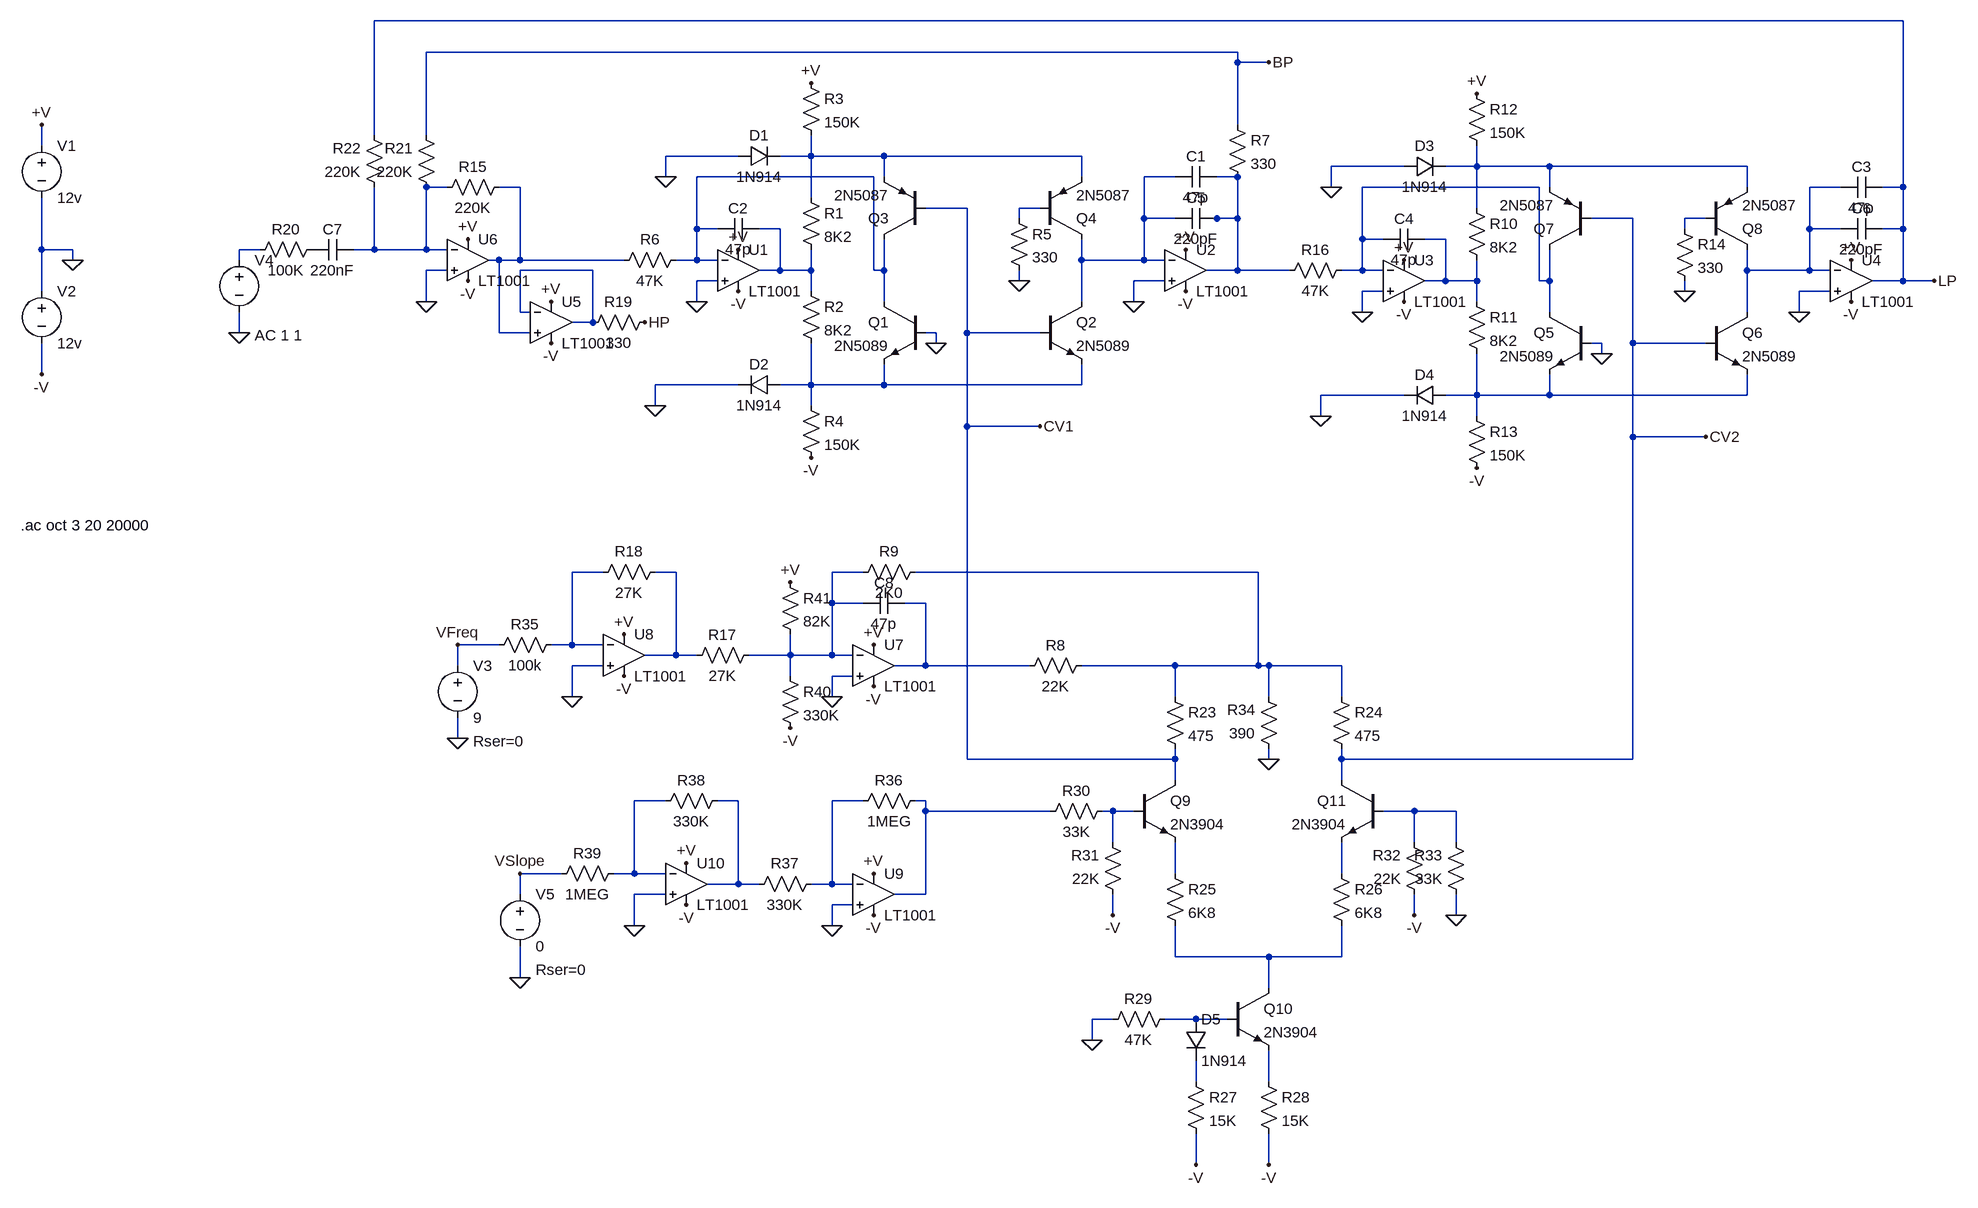
[diagram p0: schematic Serge%20VCFS.asc]
Serge%20VCFS.asc, the LTspice schematic file:
Version 4
SHEET 1 2620 1656
WIRE 2496 -176 144 -176
WIRE 1472 -128 224 -128
WIRE 1472 -112 1472 -128
WIRE 1520 -112 1472 -112
WIRE 1472 -16 1472 -112
WIRE 144 0 144 -176
WIRE 224 0 224 -128
WIRE -368 16 -368 -16
WIRE 704 32 592 32
WIRE 816 32 816 0
WIRE 816 32 768 32
WIRE 928 32 816 32
WIRE 1232 32 928 32
WIRE 1728 48 1616 48
WIRE 1840 48 1840 16
WIRE 1840 48 1792 48
WIRE 1952 48 1840 48
WIRE 2256 48 1952 48
WIRE 592 64 592 32
WIRE 912 64 640 64
WIRE 928 64 928 32
WIRE 1232 64 1232 32
WIRE 1376 64 1328 64
WIRE 1472 64 1440 64
WIRE 256 80 224 80
WIRE 368 80 336 80
WIRE 1616 80 1616 48
WIRE 1936 80 1664 80
WIRE 1952 80 1952 48
WIRE 2256 80 2256 48
WIRE 2400 80 2352 80
WIRE 2496 80 2496 -176
WIRE 2496 80 2464 80
WIRE 816 96 816 32
WIRE 1056 112 992 112
WIRE 1168 112 1136 112
WIRE 1840 112 1840 48
WIRE 1136 128 1136 112
WIRE 1328 128 1328 64
WIRE 1376 128 1328 128
WIRE 1440 128 1424 128
WIRE 1472 128 1472 64
WIRE 1472 128 1440 128
WIRE 2080 128 2016 128
WIRE 2192 128 2160 128
WIRE 640 144 640 64
WIRE 672 144 640 144
WIRE 768 144 736 144
WIRE 2160 144 2160 128
WIRE 2352 144 2352 80
WIRE 2400 144 2352 144
WIRE 2496 144 2496 80
WIRE 2496 144 2464 144
WIRE 1664 160 1664 80
WIRE 1696 160 1664 160
WIRE 1792 160 1760 160
WIRE -368 176 -368 96
WIRE -320 176 -368 176
WIRE -32 176 -64 176
WIRE 144 176 144 80
WIRE 144 176 112 176
WIRE 224 176 224 80
WIRE 224 176 144 176
WIRE 256 176 224 176
WIRE -320 192 -320 176
WIRE -64 192 -64 176
WIRE 336 192 320 192
WIRE 368 192 368 80
WIRE 368 192 336 192
WIRE 528 192 368 192
WIRE 640 192 640 144
WIRE 640 192 608 192
WIRE 672 192 640 192
WIRE 1232 192 1232 160
WIRE 1328 192 1328 128
WIRE 1328 192 1232 192
WIRE 1360 192 1328 192
WIRE 256 208 224 208
WIRE 480 208 368 208
WIRE 768 208 768 144
WIRE 768 208 736 208
WIRE 816 208 816 176
WIRE 816 208 768 208
WIRE 912 208 912 64
WIRE 928 208 928 160
WIRE 928 208 912 208
WIRE 1472 208 1472 128
WIRE 1472 208 1424 208
WIRE 1552 208 1472 208
WIRE 1664 208 1664 160
WIRE 1664 208 1632 208
WIRE 1696 208 1664 208
WIRE 2256 208 2256 176
WIRE 2352 208 2352 144
WIRE 2352 208 2256 208
WIRE 2384 208 2352 208
WIRE 672 224 640 224
WIRE 1136 224 1136 208
WIRE 1360 224 1312 224
WIRE 1792 224 1792 160
WIRE 1792 224 1760 224
WIRE 1840 224 1840 192
WIRE 1840 224 1792 224
WIRE 1936 224 1936 80
WIRE 1952 224 1952 176
WIRE 1952 224 1936 224
WIRE 2496 224 2496 144
WIRE 2496 224 2448 224
WIRE 2544 224 2496 224
WIRE -368 240 -368 176
WIRE 816 240 816 208
WIRE 1696 240 1664 240
WIRE 2160 240 2160 224
WIRE 2384 240 2336 240
WIRE 224 256 224 208
WIRE 640 256 640 224
WIRE 928 256 928 208
WIRE 1232 256 1232 192
WIRE 1312 256 1312 224
WIRE 1840 256 1840 224
WIRE 368 272 368 208
WIRE 384 272 368 272
WIRE 1664 272 1664 240
WIRE 1952 272 1952 224
WIRE 2256 272 2256 208
WIRE 2336 272 2336 240
WIRE 480 288 480 208
WIRE 480 288 448 288
WIRE -64 304 -64 272
WIRE 336 304 336 192
WIRE 384 304 336 304
WIRE 1008 304 992 304
WIRE 1056 304 1056 112
WIRE 1168 304 1056 304
WIRE 1008 320 1008 304
WIRE 2032 320 2016 320
WIRE 2080 320 2080 128
WIRE 2192 320 2080 320
WIRE 2032 336 2032 320
WIRE -368 368 -368 320
WIRE 704 384 576 384
WIRE 816 384 816 320
WIRE 816 384 768 384
WIRE 928 384 928 352
WIRE 928 384 816 384
WIRE 1232 384 1232 352
WIRE 1232 384 928 384
WIRE 1728 400 1600 400
WIRE 1840 400 1840 336
WIRE 1840 400 1792 400
WIRE 1952 400 1952 368
WIRE 1952 400 1840 400
WIRE 2256 400 2256 368
WIRE 2256 400 1952 400
WIRE 576 416 576 384
WIRE 816 416 816 384
WIRE 1600 432 1600 400
WIRE 1840 432 1840 400
WIRE 1056 448 1056 304
WIRE 1168 448 1056 448
WIRE 2080 464 2080 320
WIRE 2192 464 2080 464
WIRE 496 672 448 672
WIRE 608 672 576 672
WIRE 896 672 848 672
WIRE 1504 672 976 672
WIRE 848 720 848 672
WIRE 896 720 848 720
WIRE 992 720 960 720
WIRE 336 784 272 784
WIRE 448 784 448 672
WIRE 448 784 416 784
WIRE 496 784 448 784
WIRE 608 800 608 672
WIRE 608 800 560 800
WIRE 640 800 608 800
WIRE 784 800 784 768
WIRE 784 800 720 800
WIRE 848 800 848 720
WIRE 848 800 784 800
WIRE 880 800 848 800
WIRE 272 816 272 784
WIRE 496 816 448 816
WIRE 992 816 992 720
WIRE 992 816 944 816
WIRE 1152 816 992 816
WIRE 1376 816 1232 816
WIRE 1504 816 1504 672
WIRE 1504 816 1376 816
WIRE 1520 816 1504 816
WIRE 1632 816 1520 816
WIRE 784 832 784 800
WIRE 880 832 848 832
WIRE 448 864 448 816
WIRE 848 864 848 832
WIRE 1376 864 1376 816
WIRE 1520 864 1520 816
WIRE 1632 864 1632 816
WIRE 272 928 272 896
WIRE 1056 960 1056 448
WIRE 1376 960 1376 944
WIRE 1376 960 1056 960
WIRE 1520 960 1520 944
WIRE 1632 960 1632 944
WIRE 2080 960 2080 464
WIRE 2080 960 1632 960
WIRE 1376 992 1376 960
WIRE 1632 992 1632 960
WIRE 592 1024 544 1024
WIRE 704 1024 672 1024
WIRE 896 1024 848 1024
WIRE 992 1024 976 1024
WIRE 992 1040 992 1024
WIRE 1184 1040 992 1040
WIRE 1280 1040 1264 1040
WIRE 1312 1040 1280 1040
WIRE 1744 1040 1696 1040
WIRE 1808 1040 1744 1040
WIRE 1280 1088 1280 1040
WIRE 1744 1088 1744 1040
WIRE 1808 1088 1808 1040
WIRE 432 1136 368 1136
WIRE 544 1136 544 1024
WIRE 544 1136 512 1136
WIRE 592 1136 544 1136
WIRE 1376 1136 1376 1088
WIRE 1632 1136 1632 1088
WIRE 704 1152 704 1024
WIRE 704 1152 656 1152
WIRE 736 1152 704 1152
WIRE 848 1152 848 1024
WIRE 848 1152 816 1152
WIRE 880 1152 848 1152
WIRE 368 1168 368 1136
WIRE 592 1168 544 1168
WIRE 992 1168 992 1040
WIRE 992 1168 944 1168
WIRE 880 1184 848 1184
WIRE 1280 1200 1280 1168
WIRE 1744 1200 1744 1168
WIRE 1808 1200 1808 1168
WIRE 544 1216 544 1168
WIRE 848 1216 848 1184
WIRE 1376 1264 1376 1216
WIRE 1520 1264 1376 1264
WIRE 1632 1264 1632 1216
WIRE 1632 1264 1520 1264
WIRE 368 1296 368 1248
WIRE 1520 1312 1520 1264
WIRE 1280 1360 1248 1360
WIRE 1408 1360 1360 1360
WIRE 1456 1360 1408 1360
WIRE 1248 1392 1248 1360
WIRE 1408 1456 1408 1424
WIRE 1520 1456 1520 1408
WIRE 1408 1584 1408 1536
WIRE 1520 1584 1520 1536
FLAG 640 256 0
FLAG 1008 320 0
FLAG 1312 256 0
FLAG 1136 224 0
FLAG 1168 448 CV1
FLAG -368 -16 +V
FLAG 704 176 +V
FLAG 1392 176 +V
FLAG 816 -80 +V
FLAG -368 368 -V
FLAG 704 240 -V
FLAG 816 496 -V
FLAG 1392 240 -V
FLAG -320 192 0
FLAG -64 304 0
FLAG 592 64 0
FLAG 576 416 0
FLAG 1664 272 0
FLAG 2032 336 0
FLAG 2336 272 0
FLAG 2160 240 0
FLAG 2192 464 CV2
FLAG 1728 192 +V
FLAG 2416 192 +V
FLAG 1840 -64 +V
FLAG 1728 256 -V
FLAG 1840 512 -V
FLAG 2416 256 -V
FLAG 1616 80 0
FLAG 1600 432 0
FLAG 416 256 +V
FLAG 288 160 +V
FLAG 416 320 -V
FLAG 288 224 -V
FLAG 224 256 0
FLAG 1520 -112 BP
FLAG 2544 224 LP
FLAG 560 288 HP
FLAG 1520 960 0
FLAG 1808 1200 0
FLAG 1248 1392 0
FLAG 1744 1200 -V
FLAG 1280 1200 -V
FLAG 1408 1584 -V
FLAG 1520 1584 -V
FLAG 848 864 0
FLAG 448 864 0
FLAG 272 928 0
FLAG 272 784 VFreq
FLAG 848 1216 0
FLAG 544 1216 0
FLAG 368 1296 0
FLAG 528 768 +V
FLAG 912 784 +V
FLAG 912 1136 +V
FLAG 624 1120 +V
FLAG 528 832 -V
FLAG 912 848 -V
FLAG 912 1200 -V
FLAG 624 1184 -V
FLAG 368 1136 VSlope
FLAG 784 912 -V
FLAG 784 688 +V
SYMBOL Opamps\\LT1001 704 144 R0
SYMATTR InstName U1
SYMBOL Opamps\\LT1001 1392 144 R0
SYMATTR InstName U2
SYMBOL npn 992 256 M0
SYMATTR InstName Q1
SYMATTR Value 2N5089
SYMBOL npn 1168 256 R0
SYMATTR InstName Q2
SYMATTR Value 2N5089
SYMBOL res 800 80 R0
SYMATTR InstName R1
SYMATTR Value 8K2
SYMBOL res 800 224 R0
SYMATTR InstName R2
SYMATTR Value 8K2
SYMBOL res 800 -96 R0
SYMATTR InstName R3
SYMATTR Value 150K
SYMBOL res 800 400 R0
SYMATTR InstName R4
SYMATTR Value 150K
SYMBOL pnp 992 160 R180
SYMATTR InstName Q3
SYMATTR Value 2N5087
SYMBOL pnp 1168 160 M180
SYMATTR InstName Q4
SYMATTR Value 2N5087
SYMBOL res 1120 112 R0
SYMATTR InstName R5
SYMATTR Value 330
SYMBOL cap 1440 48 R90
WINDOW 0 0 32 VBottom 0
WINDOW 3 32 32 VTop 0
SYMATTR InstName C1
SYMATTR Value 47p
SYMBOL cap 736 128 R90
WINDOW 0 0 32 VBottom 0
WINDOW 3 32 32 VTop 0
SYMATTR InstName C2
SYMATTR Value 47p
SYMBOL voltage -368 0 R0
WINDOW 123 0 0 Left 0
WINDOW 39 0 0 Left 0
SYMATTR InstName V1
SYMATTR Value 12v
SYMBOL voltage -368 224 R0
WINDOW 123 0 0 Left 0
WINDOW 39 0 0 Left 0
SYMATTR InstName V2
SYMATTR Value 12v
SYMBOL voltage -64 176 R0
WINDOW 123 24 132 Left 0
WINDOW 39 0 0 Left 0
SYMATTR Value2 AC 1 1
SYMATTR InstName V4
SYMATTR Value ""
SYMBOL diode 704 48 R270
WINDOW 0 32 32 VTop 0
WINDOW 3 0 32 VBottom 0
SYMATTR InstName D1
SYMATTR Value 1N914
SYMBOL diode 768 368 R90
WINDOW 0 0 32 VBottom 0
WINDOW 3 32 32 VTop 0
SYMATTR InstName D2
SYMATTR Value 1N914
SYMBOL Opamps\\LT1001 1728 160 R0
SYMATTR InstName U3
SYMBOL Opamps\\LT1001 2416 160 R0
SYMATTR InstName U4
SYMBOL npn 2016 272 M0
SYMATTR InstName Q5
SYMATTR Value 2N5089
SYMBOL npn 2192 272 R0
SYMATTR InstName Q6
SYMATTR Value 2N5089
SYMBOL res 1824 96 R0
SYMATTR InstName R10
SYMATTR Value 8K2
SYMBOL res 1824 240 R0
SYMATTR InstName R11
SYMATTR Value 8K2
SYMBOL res 1824 -80 R0
SYMATTR InstName R12
SYMATTR Value 150K
SYMBOL res 1824 416 R0
SYMATTR InstName R13
SYMATTR Value 150K
SYMBOL pnp 2016 176 R180
SYMATTR InstName Q7
SYMATTR Value 2N5087
SYMBOL pnp 2192 176 M180
SYMATTR InstName Q8
SYMATTR Value 2N5087
SYMBOL res 2144 128 R0
SYMATTR InstName R14
SYMATTR Value 330
SYMBOL cap 2464 64 R90
WINDOW 0 0 32 VBottom 0
WINDOW 3 32 32 VTop 0
SYMATTR InstName C3
SYMATTR Value 47p
SYMBOL cap 1760 144 R90
WINDOW 0 0 32 VBottom 0
WINDOW 3 32 32 VTop 0
SYMATTR InstName C4
SYMATTR Value 47p
SYMBOL res 1648 192 R90
WINDOW 0 0 56 VBottom 0
WINDOW 3 32 56 VTop 0
SYMATTR InstName R16
SYMATTR Value 47K
SYMBOL diode 1728 64 R270
WINDOW 0 32 32 VTop 0
WINDOW 3 0 32 VBottom 0
SYMATTR InstName D3
SYMATTR Value 1N914
SYMBOL diode 1792 384 R90
WINDOW 0 0 32 VBottom 0
WINDOW 3 32 32 VTop 0
SYMATTR InstName D4
SYMATTR Value 1N914
SYMBOL cap 1440 112 R90
WINDOW 0 0 32 VBottom 0
WINDOW 3 32 32 VTop 0
SYMATTR InstName C5
SYMATTR Value 220pF
SYMBOL cap 2464 128 R90
WINDOW 0 0 32 VBottom 0
WINDOW 3 32 32 VTop 0
SYMATTR InstName C6
SYMATTR Value 220pF
SYMBOL res 624 176 R90
WINDOW 0 0 56 VBottom 0
WINDOW 3 32 56 VTop 0
SYMATTR InstName R6
SYMATTR Value 47K
SYMBOL Opamps\\LT1001 416 224 R0
SYMATTR InstName U5
SYMBOL Opamps\\LT1001 288 128 R0
SYMATTR InstName U6
SYMBOL res 352 64 R90
WINDOW 0 0 56 VBottom 0
WINDOW 3 32 56 VTop 0
SYMATTR InstName R15
SYMATTR Value 220K
SYMBOL res 576 272 R90
WINDOW 0 0 56 VBottom 0
WINDOW 3 32 56 VTop 0
SYMATTR InstName R19
SYMATTR Value 330
SYMBOL res 64 160 R90
WINDOW 0 0 56 VBottom 0
WINDOW 3 32 56 VTop 0
SYMATTR InstName R20
SYMATTR Value 100K
SYMBOL res 240 96 R180
WINDOW 0 36 76 Left 0
WINDOW 3 36 40 Left 0
SYMATTR InstName R21
SYMATTR Value 220K
SYMBOL res 160 96 R180
WINDOW 0 36 76 Left 0
WINDOW 3 36 40 Left 0
SYMATTR InstName R22
SYMATTR Value 220K
SYMBOL cap 112 160 R90
WINDOW 0 0 32 VBottom 0
WINDOW 3 32 32 VTop 0
SYMATTR InstName C7
SYMATTR Value 220nF
SYMBOL res 1456 -32 R0
SYMATTR InstName R7
SYMATTR Value 330
SYMBOL res 1360 848 R0
SYMATTR InstName R23
SYMATTR Value 475
SYMBOL res 1616 848 R0
SYMATTR InstName R24
SYMATTR Value 475
SYMBOL res 1360 1120 R0
SYMATTR InstName R25
SYMATTR Value 6K8
SYMBOL res 1616 1120 R0
SYMATTR InstName R26
SYMATTR Value 6K8
SYMBOL npn 1312 992 R0
SYMATTR InstName Q9
SYMATTR Value 2N3904
SYMBOL npn 1456 1312 R0
SYMATTR InstName Q10
SYMATTR Value 2N3904
SYMBOL npn 1696 992 M0
SYMATTR InstName Q11
SYMATTR Value 2N3904
SYMBOL diode 1392 1360 R0
SYMATTR InstName D5
SYMATTR Value 1N914
SYMBOL res 1392 1440 R0
SYMATTR InstName R27
SYMATTR Value 15K
SYMBOL res 1504 1440 R0
SYMATTR InstName R28
SYMATTR Value 15K
SYMBOL res 1376 1344 R90
WINDOW 0 0 56 VBottom 0
WINDOW 3 32 56 VTop 0
SYMATTR InstName R29
SYMATTR Value 47K
SYMBOL res 1280 1024 R90
WINDOW 0 0 56 VBottom 0
WINDOW 3 32 56 VTop 0
SYMATTR InstName R30
SYMATTR Value 33K
SYMBOL res 1296 1184 R180
WINDOW 0 36 76 Left 0
WINDOW 3 36 40 Left 0
SYMATTR InstName R31
SYMATTR Value 22K
SYMBOL res 1760 1184 R180
WINDOW 0 36 76 Left 0
WINDOW 3 36 40 Left 0
SYMATTR InstName R32
SYMATTR Value 22K
SYMBOL res 1824 1184 R180
WINDOW 0 36 76 Left 0
WINDOW 3 36 40 Left 0
SYMATTR InstName R33
SYMATTR Value 33K
SYMBOL res 1536 960 R180
WINDOW 0 36 76 Left 0
WINDOW 3 36 40 Left 0
SYMATTR InstName R34
SYMATTR Value 390
SYMBOL res 1248 800 R90
WINDOW 0 0 56 VBottom 0
WINDOW 3 32 56 VTop 0
SYMATTR InstName R8
SYMATTR Value 22K
SYMBOL Opamps\\LT1001 912 752 R0
SYMATTR InstName U7
SYMBOL Opamps\\LT1001 528 736 R0
SYMATTR InstName U8
SYMBOL res 992 656 R90
WINDOW 0 0 56 VBottom 0
WINDOW 3 32 56 VTop 0
SYMATTR InstName R9
SYMATTR Value 2K0
SYMBOL res 736 784 R90
WINDOW 0 0 56 VBottom 0
WINDOW 3 32 56 VTop 0
SYMATTR InstName R17
SYMATTR Value 27K
SYMBOL res 592 656 R90
WINDOW 0 0 56 VBottom 0
WINDOW 3 32 56 VTop 0
SYMATTR InstName R18
SYMATTR Value 27K
SYMBOL res 432 768 R90
WINDOW 0 0 56 VBottom 0
WINDOW 3 32 56 VTop 0
SYMATTR InstName R35
SYMATTR Value 100k
SYMBOL cap 960 704 R90
WINDOW 0 0 32 VBottom 0
WINDOW 3 32 32 VTop 0
SYMATTR InstName C8
SYMATTR Value 47p
SYMBOL voltage 272 800 R0
WINDOW 123 0 0 Left 0
WINDOW 39 24 132 Left 0
SYMATTR InstName V3
SYMATTR Value 9
SYMATTR SpiceLine Rser=0
SYMBOL Opamps\\LT1001 912 1104 R0
SYMATTR InstName U9
SYMBOL Opamps\\LT1001 624 1088 R0
SYMATTR InstName U10
SYMBOL res 992 1008 R90
WINDOW 0 0 56 VBottom 0
WINDOW 3 32 56 VTop 0
SYMATTR InstName R36
SYMATTR Value 1MEG
SYMBOL res 832 1136 R90
WINDOW 0 0 56 VBottom 0
WINDOW 3 32 56 VTop 0
SYMATTR InstName R37
SYMATTR Value 330K
SYMBOL res 688 1008 R90
WINDOW 0 0 56 VBottom 0
WINDOW 3 32 56 VTop 0
SYMATTR InstName R38
SYMATTR Value 330K
SYMBOL res 528 1120 R90
WINDOW 0 0 56 VBottom 0
WINDOW 3 32 56 VTop 0
SYMATTR InstName R39
SYMATTR Value 1MEG
SYMBOL voltage 368 1152 R0
WINDOW 123 0 0 Left 0
WINDOW 39 24 132 Left 0
SYMATTR InstName V5
SYMATTR Value 0
SYMATTR SpiceLine Rser=0
SYMBOL res 768 816 R0
SYMATTR InstName R40
SYMATTR Value 330K
SYMBOL res 768 672 R0
SYMATTR InstName R41
SYMATTR Value 82K
TEXT -400 600 Left 0 !.ac oct 3 20 20000

The netlist it stands for:
* Serge%20VCFS.asc
XU1 0 N003 +V -V N012 LT1001  ; pins In+ In- V+ V- OUT
XU2 0 N004 +V -V N005 LT1001  ; pins In+ In- V+ V- OUT
Q1 N003 0 N016 0 2N5089
Q2 N004 CV1 N016 0 2N5089
R1 N001 N012 8K2
R2 N012 N016 8K2
R3 +V N001 150K
R4 N016 -V 150K
Q3 N003 CV1 N001 0 2N5087
Q4 N004 N010 N001 0 2N5087
R5 N010 0 330
C1 N005 N004 47p
C2 N012 N003 47p
V1 +V 0 12v
V2 0 -V 12v
V4 N014 0 AC 1 1
D1 0 N001 1N914
D2 N016 0 1N914
XU3 0 N008 +V -V N013 LT1001  ; pins In+ In- V+ V- OUT
XU4 0 N009 +V -V LP LT1001  ; pins In+ In- V+ V- OUT
Q5 N008 0 N017 0 2N5089
Q6 N009 CV2 N017 0 2N5089
R10 N002 N013 8K2
R11 N013 N017 8K2
R12 +V N002 150K
R13 N017 -V 150K
Q7 N008 CV2 N002 0 2N5087
Q8 N009 N011 N002 0 2N5087
R14 N011 0 330
C3 LP N009 47p
C4 N013 N008 47p
R16 N008 N005 47K
D3 0 N002 1N914
D4 N017 0 1N914
C5 N005 N004 220pF
C6 LP N009 220pF
R6 N003 N007 47K
XU5 N007 N015 +V -V N015 LT1001  ; pins In+ In- V+ V- OUT
XU6 0 N006 +V -V N007 LT1001  ; pins In+ In- V+ V- OUT
R15 N007 N006 220K
R19 HP N015 330
R20 P001 N014 100K
R21 N006 BP 220K
R22 N006 LP 220K
C7 N006 P001 220nF
R7 BP N005 330
R23 N021 CV1 475
R24 N021 CV2 475
R25 N029 N031 6K8
R26 N030 N031 6K8
Q9 CV1 N027 N029 0 2N3904
Q10 N031 N032 N034 0 2N3904
Q11 CV2 N028 N030 0 2N3904
D5 N032 N033 1N914
R27 N033 -V 15K
R28 N034 -V 15K
R29 N032 0 47K
R30 N027 N026 33K
R31 -V N027 22K
R32 -V N028 22K
R33 0 N028 33K
R34 0 N021 390
R8 N021 N022 22K
XU7 0 N020 +V -V N022 LT1001  ; pins In+ In- V+ V- OUT
XU8 0 N018 +V -V N019 LT1001  ; pins In+ In- V+ V- OUT
R9 N021 N020 2K0
R17 N020 N019 27K
R18 N019 N018 27K
R35 N018 VFreq 100k
C8 N022 N020 47p
V3 VFreq 0 9 Rser=0
XU9 0 N025 +V -V N026 LT1001  ; pins In+ In- V+ V- OUT
XU10 0 N023 +V -V N024 LT1001  ; pins In+ In- V+ V- OUT
R36 N026 N025 1MEG
R37 N025 N024 330K
R38 N024 N023 330K
R39 N023 VSlope 1MEG
V5 VSlope 0 0 Rser=0
R40 N020 -V 330K
R41 +V N020 82K
.model D D
.lib standard.dio
.model NPN NPN
.model PNP PNP
.lib standard.bjt
.ac oct 3 20 20000
.lib LTC.lib
.backanno
.end